# EAGLE design RDN_3103 (EAGLE 9.6.2)

## Sheet 1 of 3
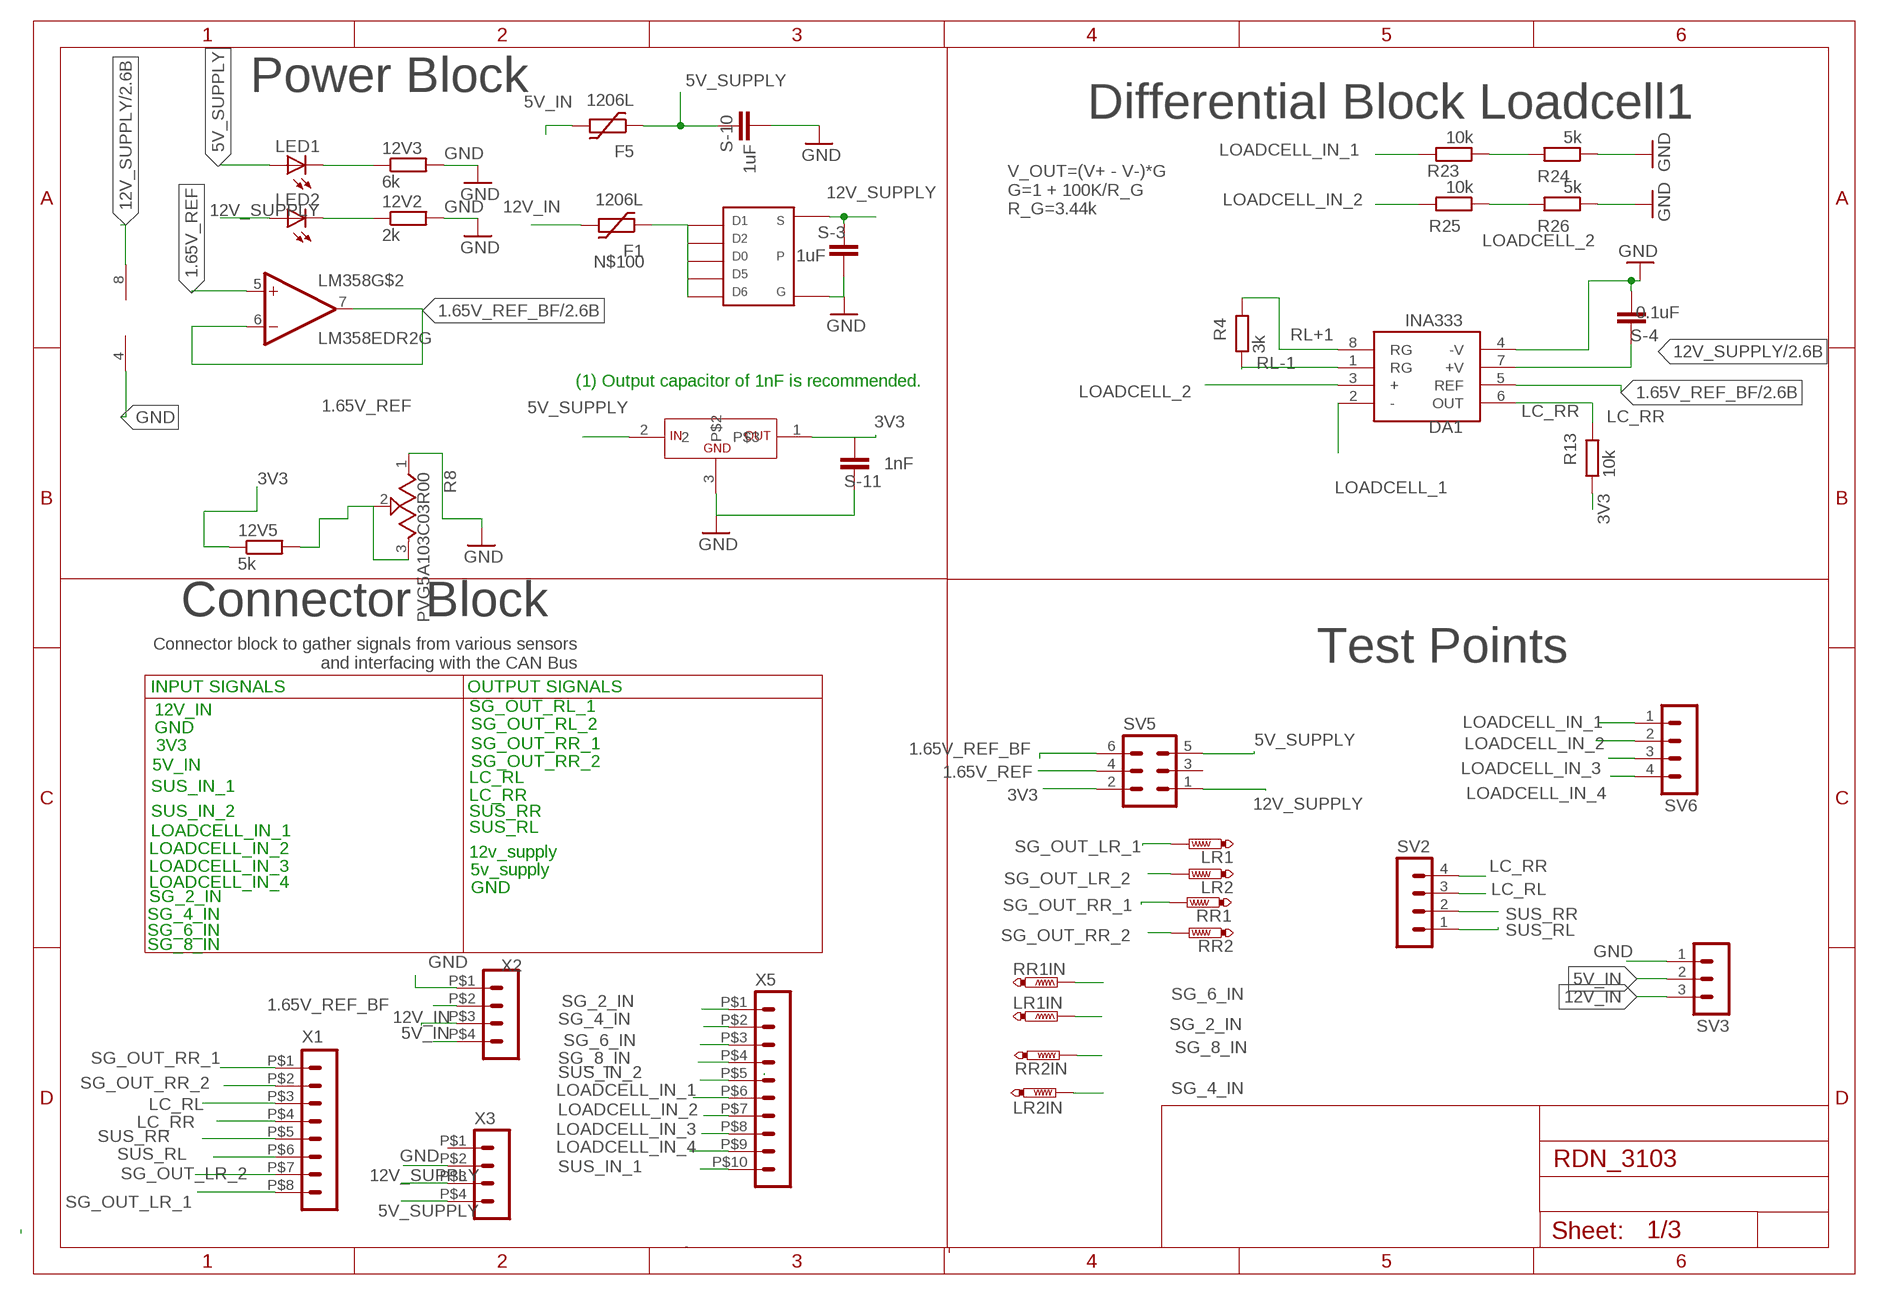
[diagram p0: schematic, sheet 1]

### Parts
12V2  2k  R-EU_R0805  [R0805]
12V3  6k  R-EU_R0805  [R0805]
12V5  5k  R-EU_R0805  [R0805]
DA1  INA333  [MSOP8]
F1  1206L  [1206L]
F5  1206L  [1206L]
LED1  LEDCHIPLED_1206  [CHIPLED_1206]
LED2  LEDCHIPLED_1206  [CHIPLED_1206]
LM358  LM358EDR2G  [SOIC-8]
LR1  PTR1PAD1-13  [P1-13]
LR1IN  PTR1PAD1-13  [P1-13]
LR2  PTR1PAD1-13  [P1-13]
LR2IN  PTR1PAD1-13  [P1-13]
R4  3k  R-EU_R0805  [R0805]
R8  PVG5A103C03R00  [TRIM_PVG5A103C03R00]
R13  10k  R-EU_R0805  [R0805]
R23  10k  R-EU_R0805  [R0805]
R24  5k  R-EU_R0805  [R0805]
R25  10k  R-EU_R0805  [R0805]
R26  5k  R-EU_R0805  [R0805]
RR1  PTR1PAD1-13  [P1-13]
RR1IN  PTR1PAD1-13  [P1-13]
RR2  PTR1PAD1-13  [P1-13]
RR2IN  PTR1PAD1-13  [P1-13]
S-3  1uF  C-EUC0805  [C0805]
S-4  0.1uF  C-EUC0805  [C0805]
S-10  1uF  C-EUC0805  [C0805]
S-11  1nF  C-EUC0805  [C0805]
SV2  MA04-1  [MA04-1]
SV3  MA03-1  [MA03-1]
SV5  MA03-2  [MA03-2]
SV6  MA04-1  [MA04-1]
U$1  TSOP-6_PMOS  [TSOP-6_PMOS]
U$3  3V3_REGULATOR  [SOT-23]
X1  HEADER_POS8_43045-0800  [43045-0800]
X2  HEADER_POS4_43045-0401  [43045-0400]
X3  HEADER_POS4_43045-0401  [43045-0400]
X5  HEADER_POS10_43045-1000  [43045-1000]

### Nets
1.65V_REF: 12V5.2 LM358.5(+IN) R8.2 R8.3 SV5.4
1.65V_REF_BF: DA1.5(REF) LM358.6(-IN) LM358.7(OUT) SV5.6 X2.P$2 ; also sheet 2,3
3V3: 12V5.1 R13.1 S-11.2 SV5.2 U$3.1 ; also sheet 2,3
5V_IN: F5.P$2 SV3.2 X2.P$4
5V_SUPPLY: F5.P$1 LED1.A S-10.1 SV5.5 U$3.2 X3.P$4 ; also sheet 3
12V_IN: F1.P$2 SV3.3 X2.P$3
12V_SUPPLY: DA1.7(+V) LED2.A LM358.8(V+) S-3.1 S-4.1 SV5.1 U$1.S X3.P$3 ; also sheet 2,3
GND: 12V2.2 12V3.2 DA1.4(-V) LM358.4(V-) R8.1 R24.1 R26.1 S-3.2 S-4.2 S-10.2 S-11.1 SV3.1 U$1.G U$3.3 X2.P$1 X3.P$2 ; also sheet 2,3
LC_RL: SV2.3 X1.P$3 ; also sheet 2
LC_RR: DA1.6(OUT) R13.2 SV2.4 X1.P$4
LOADCELL_1: DA1.2(-) R23.1 R24.2
LOADCELL_2: DA1.3(+) R25.1 R26.2
LOADCELL_IN_1: R23.2 SV6.1 X5.P$6
LOADCELL_IN_2: R25.2 SV6.2 X5.P$7
LOADCELL_IN_3: SV6.3 X5.P$8 ; also sheet 2
LOADCELL_IN_4: SV6.4 X5.P$9 ; also sheet 2
N$5: 12V2.1 LED2.C
N$29: 12V3.1 LED1.C
N$100: F1.P$1 U$1.1 U$1.2 U$1.5 U$1.6 U$1.D(D0)
RL+1: DA1.8(RG) R4.2
RL-1: DA1.1(RG) R4.1
SG_2_IN: LR1IN.TP X5.P$1 ; also sheet 2,3
SG_4_IN: LR2IN.TP X5.P$2 ; also sheet 2,3
SG_6_IN: RR1IN.TP X5.P$3 ; also sheet 2,3
SG_8_IN: RR2IN.TP X5.P$4 ; also sheet 3
SG_OUT_LR_1: LR1.TP X1.P$8 ; also sheet 2
SG_OUT_LR_2: LR2.TP X1.P$7 ; also sheet 2
SG_OUT_RR_1: RR1.TP X1.P$1 ; also sheet 2
SG_OUT_RR_2: RR2.TP X1.P$2 ; also sheet 3
SUS_IN_1: X5.P$10 ; also sheet 3
SUS_IN_2: X5.P$5 ; also sheet 3
SUS_RL: SV2.1 X1.P$6 ; also sheet 3
SUS_RR: SV2.2 X1.P$5 ; also sheet 3
Unconnected: LM358.1(OUT) LM358.2(-IN) LM358.3(+IN) SV5.3 X3.P$1

### Notes on the sheet
- Power Block
- Differential Block Loadcell1
- V_OUT=(V+ - V-)*G
  G=1 + 100K/R_G
  R_G=3.44k
- (1) Output capacitor of 1nF is recommended.
- Connector Block
- Connector block to gather signals from various sensors
   and interfacing with the CAN Bus
- Test Points
- INPUT SIGNALS | OUTPUT SIGNALS
- 12V_IN | SG_OUT_RL_1
- GND | SG_OUT_RL_2
- 3V3 | SG_OUT_RR_1
- 5V_IN | SG_OUT_RR_2
- LC_RL
- SUS_IN_1
- LC_RR
- SUS_IN_2 | SUS_RR
- LOADCELL_IN_1 | SUS_RL
- LOADCELL_IN_2 | 12v_supply
- LOADCELL_IN_3 | 5v_supply
- LOADCELL_IN_4
- GND
- SG_2_IN
- SG_4_IN
- SG_6_IN
- SG_8_IN

## Sheet 2 of 3
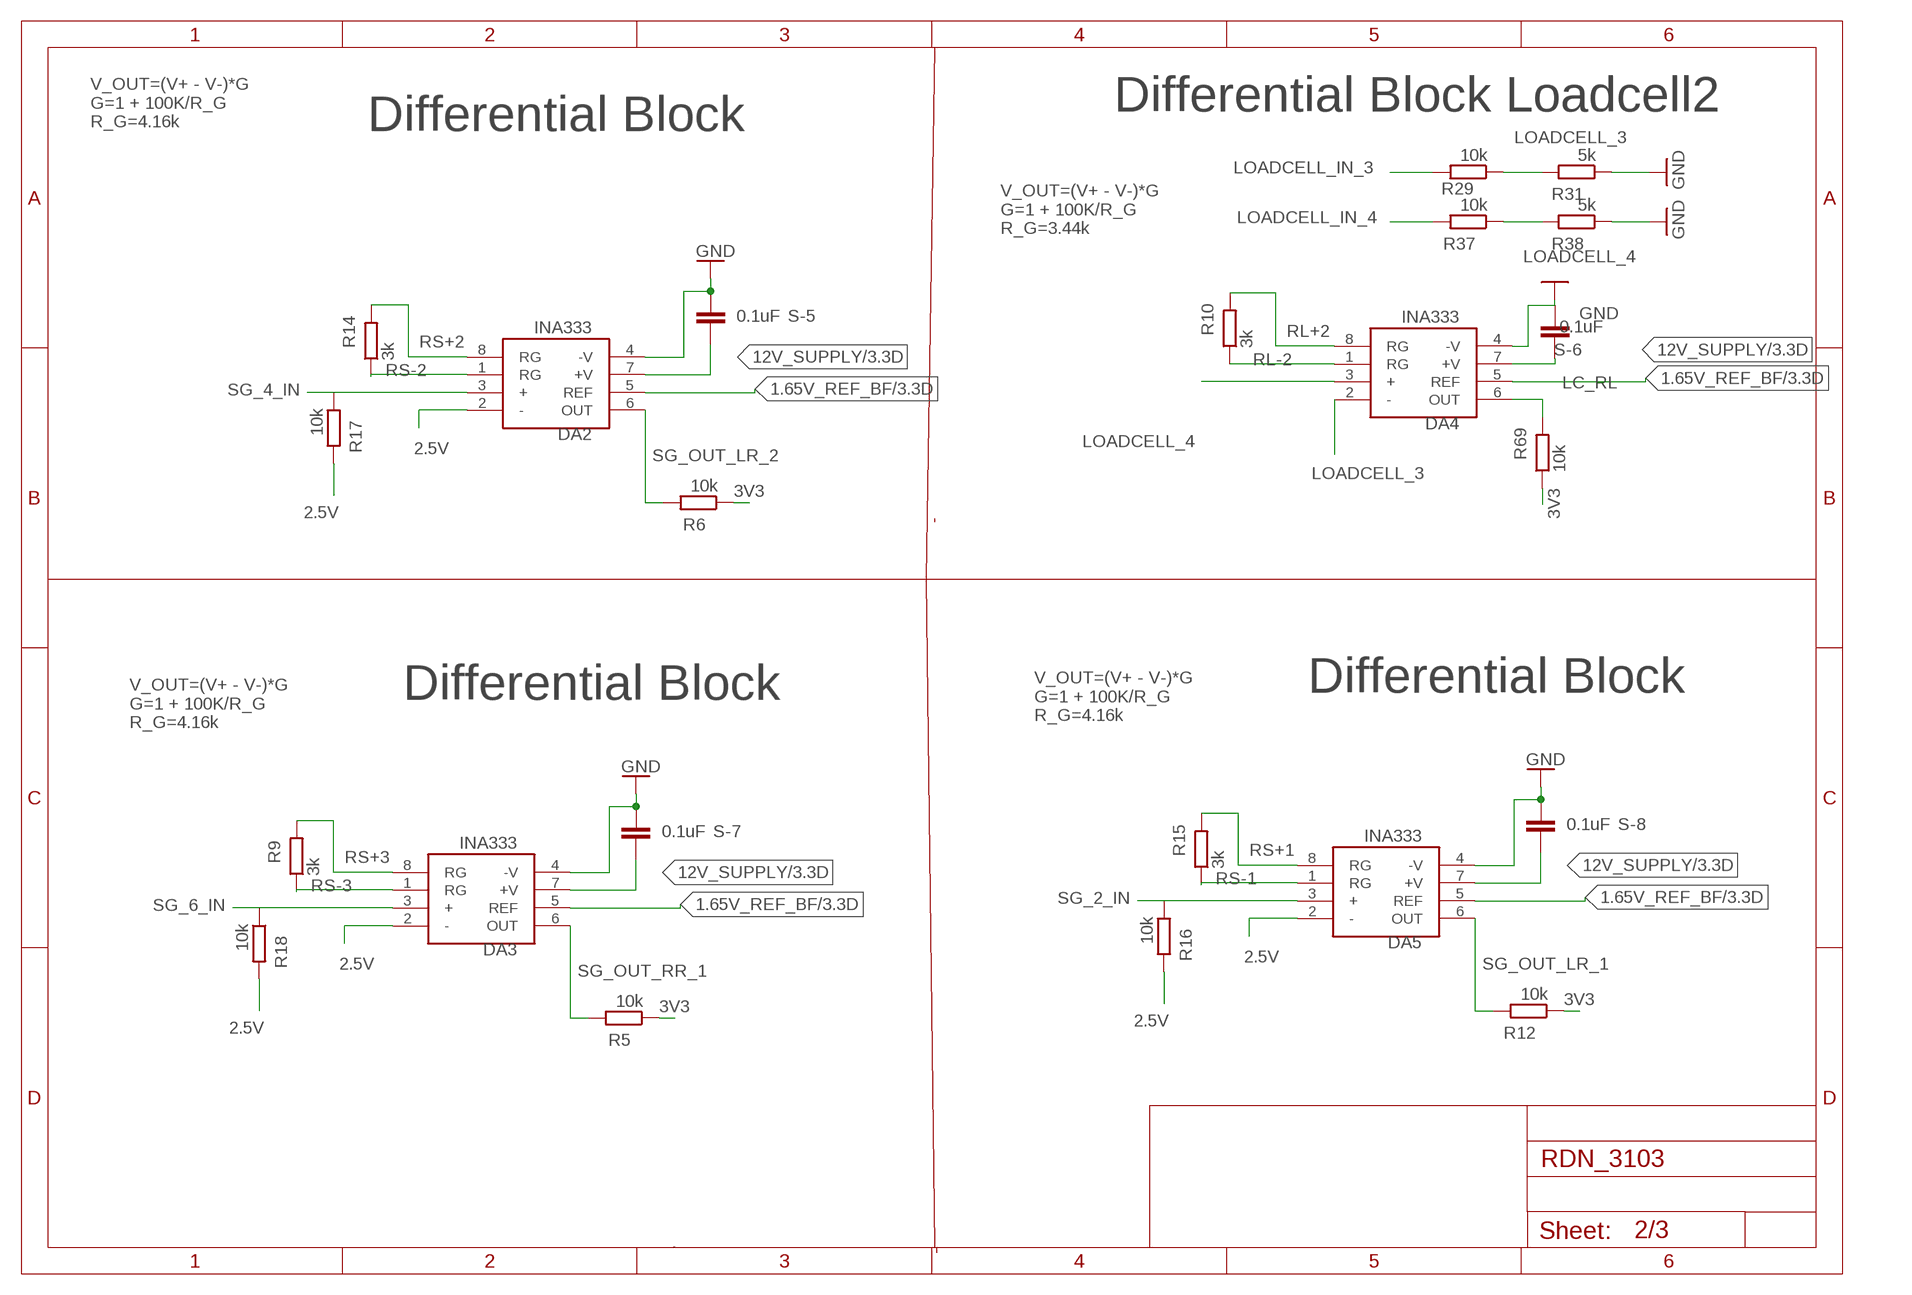
[diagram p1: schematic, sheet 2]

### Parts
DA2  INA333  [MSOP8]
DA3  INA333  [MSOP8]
DA4  INA333  [MSOP8]
DA5  INA333  [MSOP8]
R5  10k  R-EU_R0805  [R0805]
R6  10k  R-EU_R0805  [R0805]
R9  3k  R-EU_R0805  [R0805]
R10  3k  R-EU_R0805  [R0805]
R12  10k  R-EU_R0805  [R0805]
R14  3k  R-EU_R0805  [R0805]
R15  3k  R-EU_R0805  [R0805]
R16  10k  R-EU_R0805  [R0805]
R17  10k  R-EU_R0805  [R0805]
R18  10k  R-EU_R0805  [R0805]
R29  10k  R-EU_R0805  [R0805]
R31  5k  R-EU_R0805  [R0805]
R37  10k  R-EU_R0805  [R0805]
R38  5k  R-EU_R0805  [R0805]
R69  10k  R-EU_R0805  [R0805]
S-5  0.1uF  C-EUC0805  [C0805]
S-6  0.1uF  C-EUC0805  [C0805]
S-7  0.1uF  C-EUC0805  [C0805]
S-8  0.1uF  C-EUC0805  [C0805]

### Nets
1.65V_REF_BF: DA2.5(REF) DA3.5(REF) DA4.5(REF) DA5.5(REF) ; also sheet 1,3
2.5V: DA2.2(-) DA3.2(-) DA5.2(-) R16.2 R17.2 R18.2 ; also sheet 3
3V3: R5.1 R6.1 R12.1 R69.1 ; also sheet 1,3
12V_SUPPLY: DA2.7(+V) DA3.7(+V) DA4.7(+V) DA5.7(+V) S-5.1 S-6.1 S-7.1 S-8.1 ; also sheet 1,3
GND: DA2.4(-V) DA3.4(-V) DA4.4(-V) DA5.4(-V) R31.1 R38.1 S-5.2 S-6.2 S-7.2 S-8.2 ; also sheet 1,3
LC_RL: DA4.6(OUT) R69.2 ; also sheet 1
LOADCELL_3: DA4.2(-) R29.1 R31.2
LOADCELL_4: DA4.3(+) R37.1 R38.2
LOADCELL_IN_3: R29.2 ; also sheet 1
LOADCELL_IN_4: R37.2 ; also sheet 1
RL+2: DA4.8(RG) R10.2
RL-2: DA4.1(RG) R10.1
RS+1: DA5.8(RG) R15.2
RS+2: DA2.8(RG) R14.2
RS+3: DA3.8(RG) R9.2
RS-1: DA5.1(RG) R15.1
RS-2: DA2.1(RG) R14.1
RS-3: DA3.1(RG) R9.1
SG_2_IN: DA5.3(+) R16.1 ; also sheet 1,3
SG_4_IN: DA2.3(+) R17.1 ; also sheet 1,3
SG_6_IN: DA3.3(+) R18.1 ; also sheet 1,3
SG_OUT_LR_1: DA5.6(OUT) R12.2 ; also sheet 1
SG_OUT_LR_2: DA2.6(OUT) R6.2 ; also sheet 1
SG_OUT_RR_1: DA3.6(OUT) R5.2 ; also sheet 1

### Notes on the sheet
- Differential Block Loadcell2
- V_OUT=(V+ - V-)*G
  G=1 + 100K/R_G
  R_G=4.16k
- Differential Block
- V_OUT=(V+ - V-)*G
  G=1 + 100K/R_G
  R_G=3.44k
- Differential Block | Differential Block
- V_OUT=(V+ - V-)*G
  G=1 + 100K/R_G
  R_G=4.16k
- V_OUT=(V+ - V-)*G
  G=1 + 100K/R_G
  R_G=4.16k

## Sheet 3 of 3
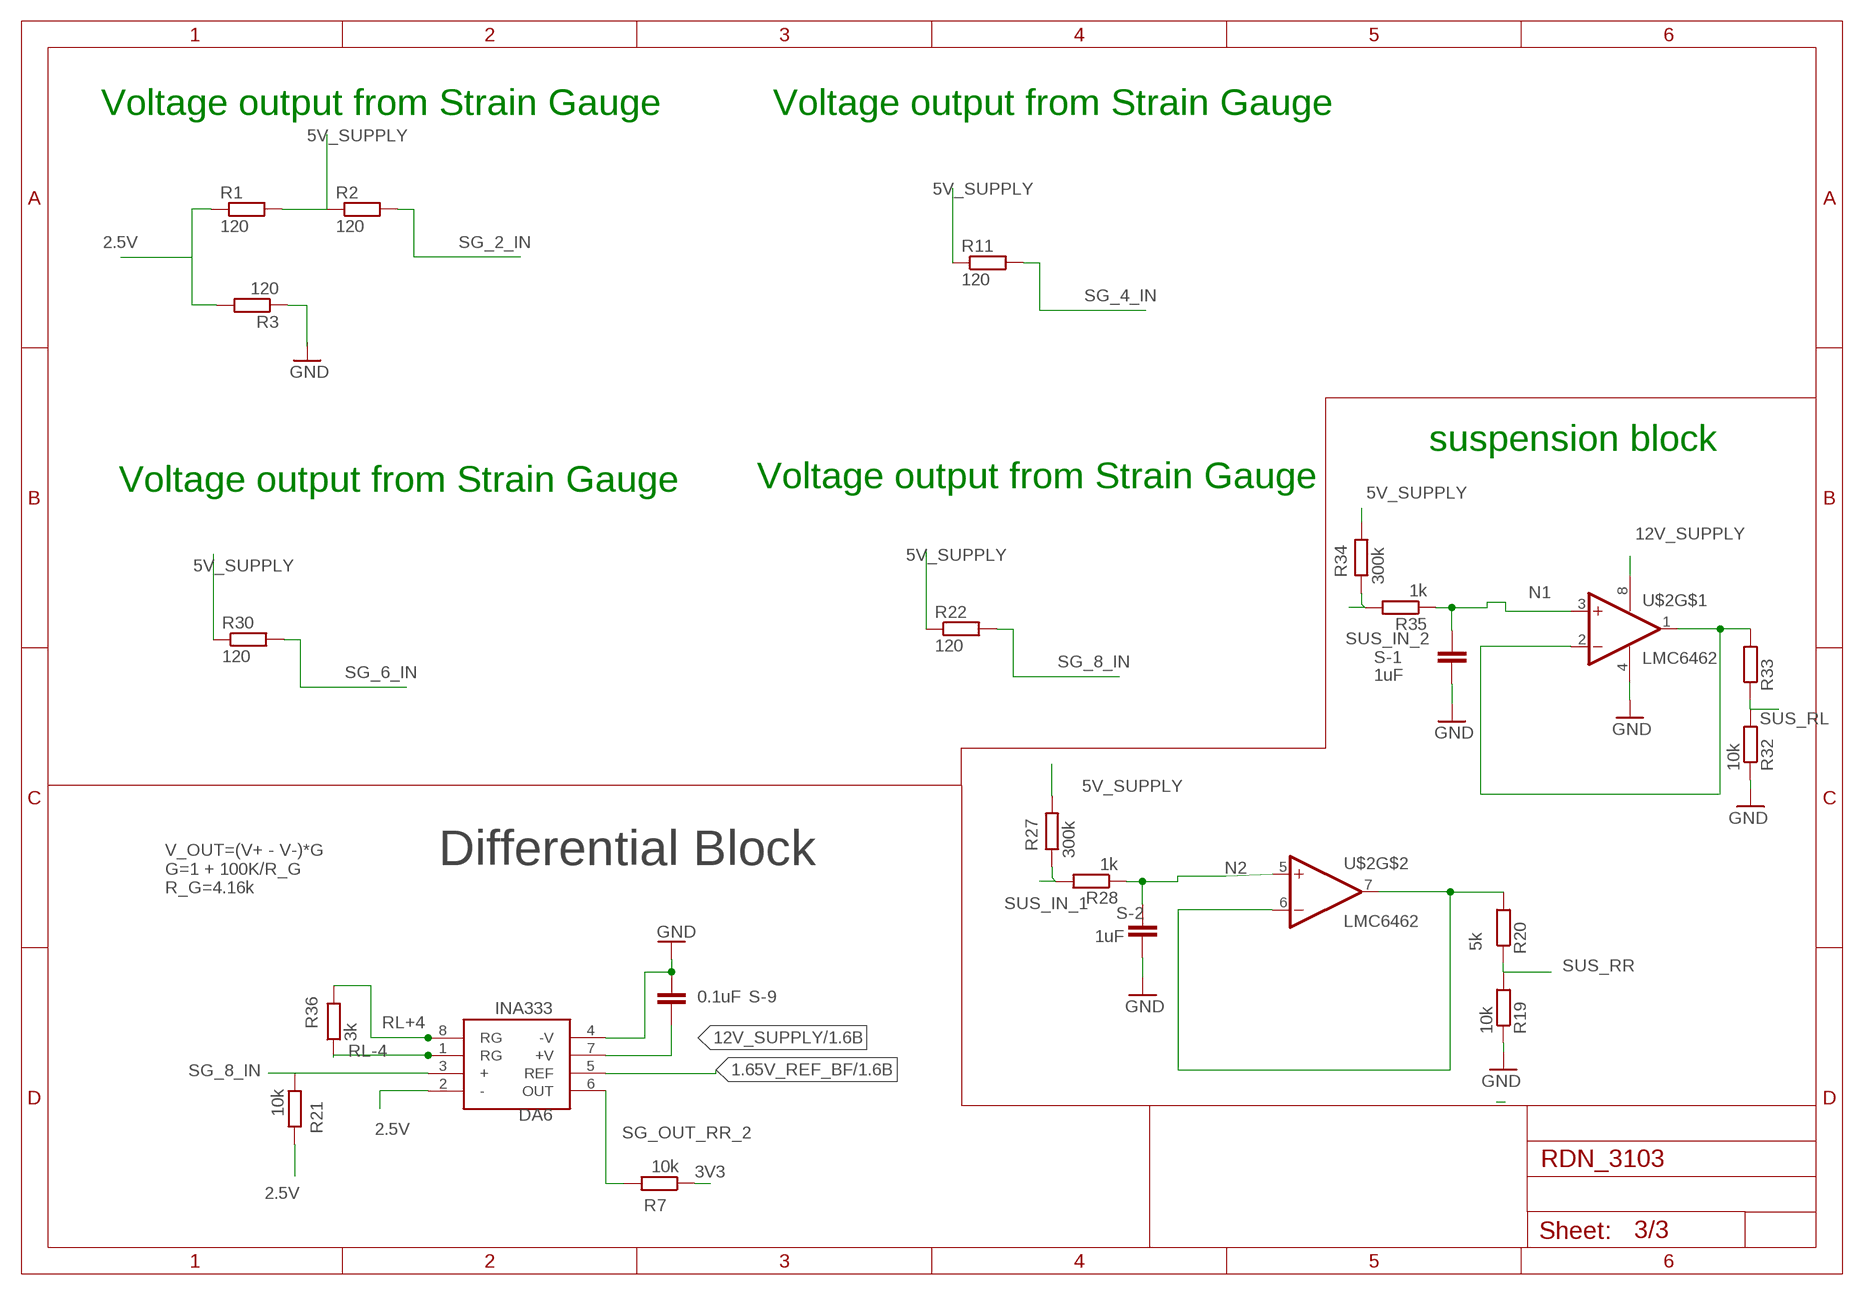
[diagram p2: schematic, sheet 3]

### Parts
DA6  INA333  [MSOP8]
R1  120  R-EU_R0805  [R0805]
R2  120  R-EU_R0805  [R0805]
R3  120  R-EU_R0805  [R0805]
R7  10k  R-EU_R0805  [R0805]
R11  120  R-EU_R0805  [R0805]
R19  10k  R-EU_R0805  [R0805]
R20  5k  R-EU_R0805  [R0805]
R21  10k  R-EU_R0805  [R0805]
R22  120  R-EU_R0805  [R0805]
R27  300k  R-EU_R0805  [R0805]
R28  1k  R-EU_R0805  [R0805]
R30  120  R-EU_R0805  [R0805]
R32  10k  R-EU_R0805  [R0805]
R33  5k  R-EU_R0805  [R0805]
R34  300k  R-EU_R0805  [R0805]
R35  1k  R-EU_R0805  [R0805]
R36  3k  R-EU_R0805  [R0805]
S-1  1uF  C-EUC0805  [C0805]
S-2  1uF  C-EUC0805  [C0805]
S-9  0.1uF  C-EUC0805  [C0805]
U$2  LMC6462  [S08]

### Nets
1.65V_REF_BF: DA6.5(REF) ; also sheet 1,2
2.5V: DA6.2(-) R1.1 R3.2 R21.2 ; also sheet 2
3V3: R7.1 ; also sheet 1,2
5V_SUPPLY: R1.2 R2.1 R11.1 R22.1 R27.2 R30.1 R34.2 ; also sheet 1
12V_SUPPLY: DA6.7(+V) S-9.1 U$2.8(V+) ; also sheet 1,2
GND: DA6.4(-V) R3.1 R19.1 R32.1 S-1.2 S-2.2 S-9.2 U$2.4(V-) ; also sheet 1,2
N1: R35.1 S-1.1 U$2.3(+IN)
N2: R28.1 S-2.1 U$2.5(+IN)
N$15: R20.2 U$2.6(-IN) U$2.7(OUT)
N$20: R33.2 U$2.1(OUT) U$2.2(-IN)
RL+4: DA6.8(RG) R36.2
RL-4: DA6.1(RG) R36.1
SG_2_IN: R2.2 ; also sheet 1,2
SG_4_IN: R11.2 ; also sheet 1,2
SG_6_IN: R30.2 ; also sheet 1,2
SG_8_IN: DA6.3(+) R21.1 R22.2 ; also sheet 1
SG_OUT_RR_2: DA6.6(OUT) R7.2 ; also sheet 1
SUS_IN_1: R27.1 R28.2 ; also sheet 1
SUS_IN_2: R34.1 R35.2 ; also sheet 1
SUS_RL: R32.2 R33.1 ; also sheet 1
SUS_RR: R19.2 R20.1 ; also sheet 1

### Notes on the sheet
- Voltage output from Strain Gauge | Voltage output from Strain Gauge
- suspension block
- Voltage output from Strain Gauge | Voltage output from Strain Gauge
- Differential Block
- V_OUT=(V+ - V-)*G
  G=1 + 100K/R_G
  R_G=4.16k

## Library data of the parts
12V2 12V3 12V5 R1-R3 R11 R22 R30 = rcl:R-EU_: RESISTOR, European symbol; SPICEPREFIX: R
DA1-DA6 = INA333:INA333: Check availability <https://pricing.snapeda.com/parts/INA333/Texas%20Instruments/view-part?ref=eda>; AVAILABILITY: Not in stock; CHECK_PRICES: https://www.snapeda.com/parts/INA333/Texas+Instruments/view-part/?ref=eda; DESCRIPTION: Instrumentation Amplifier 1 Circuit Rail-to-Rail 8-CDIP SB; MF: Texas Instruments; MP: INA333; PACKAGE: None; PRICE: None; SNAPEDA_LINK: https://www.snapeda.com/parts/INA333/Texas+Instruments/view-part/?ref=snap
F1 F5 = IIT_BOMBAY_Racing:1206L
LED1 = led:LED: LED OSRAM: - CHIPLED LG R971, LG N971, LY N971, LG Q971, LY Q971, LO R971, LY R971 LH N974, LH R974 LS Q976, LO Q976, LY Q976 LO Q996 - Hyper CHIPLED LW Q18S LB Q993, LB Q99A, LB R99A - SideLED LS A670, LO A670, LY A670, LG A670, LP A670 LB A673, LV A673, LT A673, LW A673 LH A674 LY A675 LS A676, LA A676, LO A676, LY A676, LW A676 LS A679, LY A679, LG A679 - Hyper Micro SIDELED® LS Y876, LA Y876, LO Y876, LY Y876 LT Y87S - SmartLED LW L88C, LW L88S LB L89C, LB L89S, LG L890 LS L89K, LO L89K, LY L89K LS L896, LA L896, LO L896, LY L896 - TOPLED LS T670, LO T670, LY T670, LG T670, LP T670 LSG T670, LSP T670, LSY T670, LOP T670, LYG T670 LG T671, LOG T671, LSG T671 LB T673, LV T673, LT T673, LW T673 LH T674 LS T676, LA T676, LO T676, LY T676, LB T676, LH T676, LSB T676, LW T676 LB T67C, LV T67C, LT T67C, LS T67K, LO T67K, LY T67K, LW E67C LS E67B, LA E67B, LO E67B, LY E67B, LB E67C, LV E67C, LT E67C LW T67C LS T679, LY T679, LG T679 LS T770, LO T770, LY T770, LG T770, LP T770 LB T773, LV T773, LT T773, LW T773 LH T774 LS E675, LA E675, LY E675, LS T675 LS T776, LA T776, LO T776, LY T776, LB T776 LHGB T686 LT T68C, LB T68C - Hyper Mini TOPLED® LB M676 - Mini TOPLED Santana® LG M470 LS M47K, LO M47K, LY M47K Source: http://www.osram.convergy.de LUXEON: - LUMILED® LXK2-PW12-R00, LXK2-PW12-S00, LXK2-PW14-U00, LXK2-PW14-V00 LXK2-PM12-R00, LXK2-PM12-S00, LXK2-PM14-U00 LXK2-PE12-Q00, LXK2-PE12-R00, LXK2-PE12-S00, LXK2-PE14-T00, LXK2-PE14-U00 LXK2-PB12-K00, LXK2-PB12-L00, LXK2-PB12-M00, LXK2-PB14-N00, LXK2-PB14-P00, LXK2-PB14-Q00 LXK2-PR12-L00, LXK2-PR12-M00, LXK2-PR14-Q00, LXK2-PR14-R00 LXK2-PD12-Q00, LXK2-PD12-R00, LXK2-PD12-S00 LXK2-PH12-R00, LXK2-PH12-S00 LXK2-PL12-P00, LXK2-PL12-Q00, LXK2-PL12-R00 Source: www.luxeon.com KINGBRIGHT: KA-3528ASYC Source: www.kingbright.com
LED2 = led:LED: LED OSRAM: - CHIPLED LG R971, LG N971, LY N971, LG Q971, LY Q971, LO R971, LY R971 LH N974, LH R974 LS Q976, LO Q976, LY Q976 LO Q996 - Hyper CHIPLED LW Q18S LB Q993, LB Q99A, LB R99A - SideLED LS A670, LO A670, LY A670, LG A670, LP A670 LB A673, LV A673, LT A673, LW A673 LH A674 LY A675 LS A676, LA A676, LO A676, LY A676, LW A676 LS A679, LY A679, LG A679 - Hyper Micro SIDELED® LS Y876, LA Y876, LO Y876, LY Y876 LT Y87S - SmartLED LW L88C, LW L88S LB L89C, LB L89S, LG L890 LS L89K, LO L89K, LY L89K LS L896, LA L896, LO L896, LY L896 - TOPLED LS T670, LO T670, LY T670, LG T670, LP T670 LSG T670, LSP T670, LSY T670, LOP T670, LYG T670 LG T671, LOG T671, LSG T671 LB T673, LV T673, LT T673, LW T673 LH T674 LS T676, LA T676, LO T676, LY T676, LB T676, LH T676, LSB T676, LW T676 LB T67C, LV T67C, LT T67C, LS T67K, LO T67K, LY T67K, LW E67C LS E67B, LA E67B, LO E67B, LY E67B, LB E67C, LV E67C, LT E67C LW T67C LS T679, LY T679, LG T679 LS T770, LO T770, LY T770, LG T770, LP T770 LB T773, LV T773, LT T773, LW T773 LH T774 LS E675, LA E675, LY E675, LS T675 LS T776, LA T776, LO T776, LY T776, LB T776 LHGB T686 LT T68C, LB T68C - Hyper Mini TOPLED® LB M676 - Mini TOPLED Santana® LG M470 LS M47K, LO M47K, LY M47K Source: http://www.osram.convergy.de LUXEON: - LUMILED® LXK2-PW12-R00, LXK2-PW12-S00, LXK2-PW14-U00, LXK2-PW14-V00 LXK2-PM12-R00, LXK2-PM12-S00, LXK2-PM14-U00 LXK2-PE12-Q00, LXK2-PE12-R00, LXK2-PE12-S00, LXK2-PE14-T00, LXK2-PE14-U00 LXK2-PB12-K00, LXK2-PB12-L00, LXK2-PB12-M00, LXK2-PB14-N00, LXK2-PB14-P00, LXK2-PB14-Q00 LXK2-PR12-L00, LXK2-PR12-M00, LXK2-PR14-Q00, LXK2-PR14-R00 LXK2-PD12-Q00, LXK2-PD12-R00, LXK2-PD12-S00 LXK2-PH12-R00, LXK2-PH12-S00 LXK2-PL12-P00, LXK2-PL12-Q00, LXK2-PL12-R00 Source: www.luxeon.com KINGBRIGHT: KA-3528ASYC Source: www.kingbright.com; SPICEPREFIX: L
LM358 = IIT_BOMBAY_Racing2:LM358EDR2G
LR1 LR1IN LR2 LR2IN RR1 RR1IN RR2 RR2IN = testpad:PTR1: TEST PIN
R4-R7 R9 R10 R12-R18 R21 R23-R26 R29 R31 R36-R38 R69 = IIT_BOMBAY_Racing:R-EU_: RESISTOR, European symbol
R8 = PVG5A103C03R00:PVG5A103C03R00: 1 kOhms 0.25W, 1/4W J Lead Surface Mount Trimmer Potentiometer Cermet 11 Turn Top Adjustment Check availability <https://pricing.snapeda.com/parts/PVG5A103C03R00/Bourns/view-part?ref=eda>; AVAILABILITY: In Stock; CHECK_PRICES: https://www.snapeda.com/parts/PVG5A103C03R00/Bourns/view-part/?ref=eda; DESCRIPTION: 10 kOhms 0.25W, 1/4W J Lead Surface Mount Trimmer Potentiometer Cermet 11.0 Turn Top Adjustment; MF: Bourns; MP: PVG5A103C03R00; PACKAGE: SMD-3 Bourns; PRICE: None; SNAPEDA_LINK: https://www.snapeda.com/parts/PVG5A103C03R00/Bourns/view-part/?ref=snap
R19 R20 R27 R28 R32-R35 = IIT_BOMBAY_Racing2:R-EU_: RESISTOR, European symbol
S-1-S-11 = IIT_BOMBAY_Racing:C-EU: CAPACITOR, European symbol
SV2 SV6 = con-lstb:MA04-1: PIN HEADER; OC_FARNELL: unknown; OC_NEWARK: unknown
SV3 = con-lstb:MA03-1: PIN HEADER; OC_FARNELL: unknown; OC_NEWARK: unknown
SV5 = con-lstb:MA03-2: PIN HEADER; OC_FARNELL: unknown; OC_NEWARK: unknown
U$1 = TSOP-6_MOS:TSOP-6_PMOS
U$2 = IIT_BOMBAY_Racing (1):LMC6462
U$3 = 3V3_REG:3V3_REGULATOR
X1 = IIT_BOMBAY_Racing (1):HEADER_POS8_?: Molex - Micro-Fit 3.0 Series connector, 3.00mm (0.118") pitch header, 8 positions.
X2 X3 = IIT_BOMBAY_Racing (1):HEADER_POS4_?: Molex - Micro-Fit 3.0 Series connector, 3.00mm (0.118") pitch header, 4 positions.
X5 = IIT_BOMBAY_Racing (1):HEADER_POS10_?: Molex - Micro-Fit 3.0 Series connector, 3.00mm (0.118") pitch header, 10 positions.

## Board
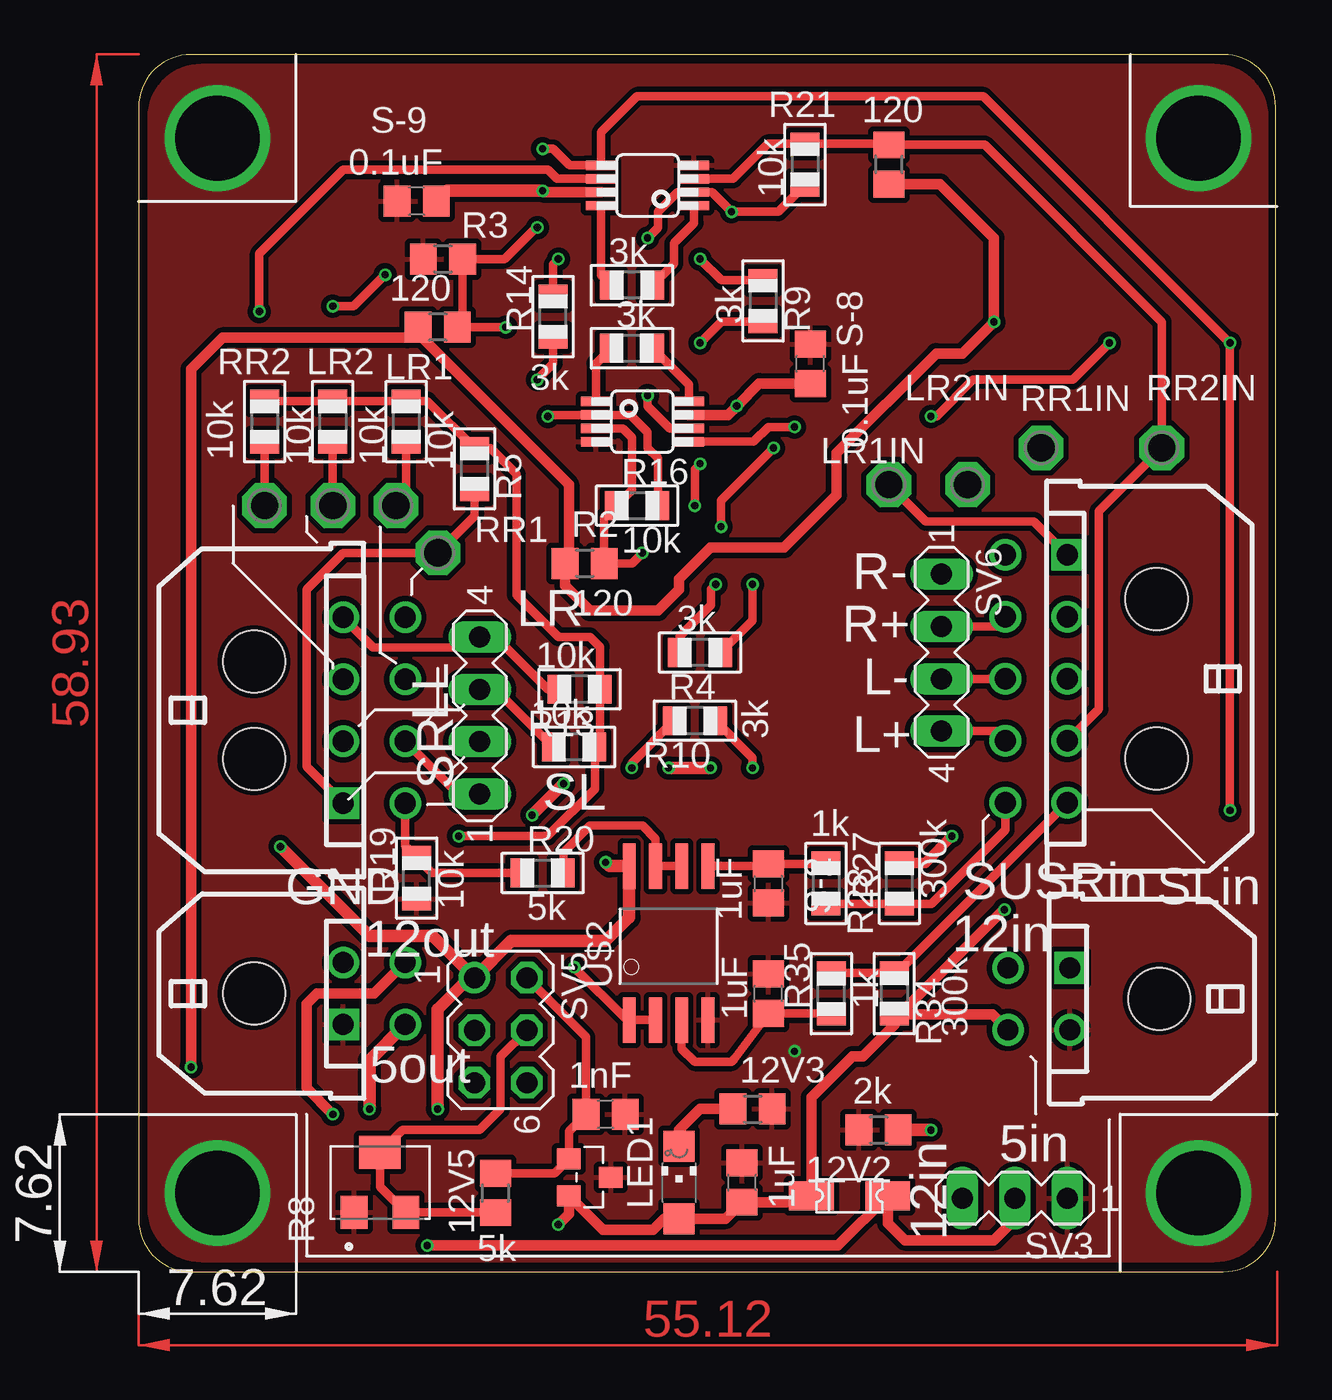
[diagram p3: board, top side]
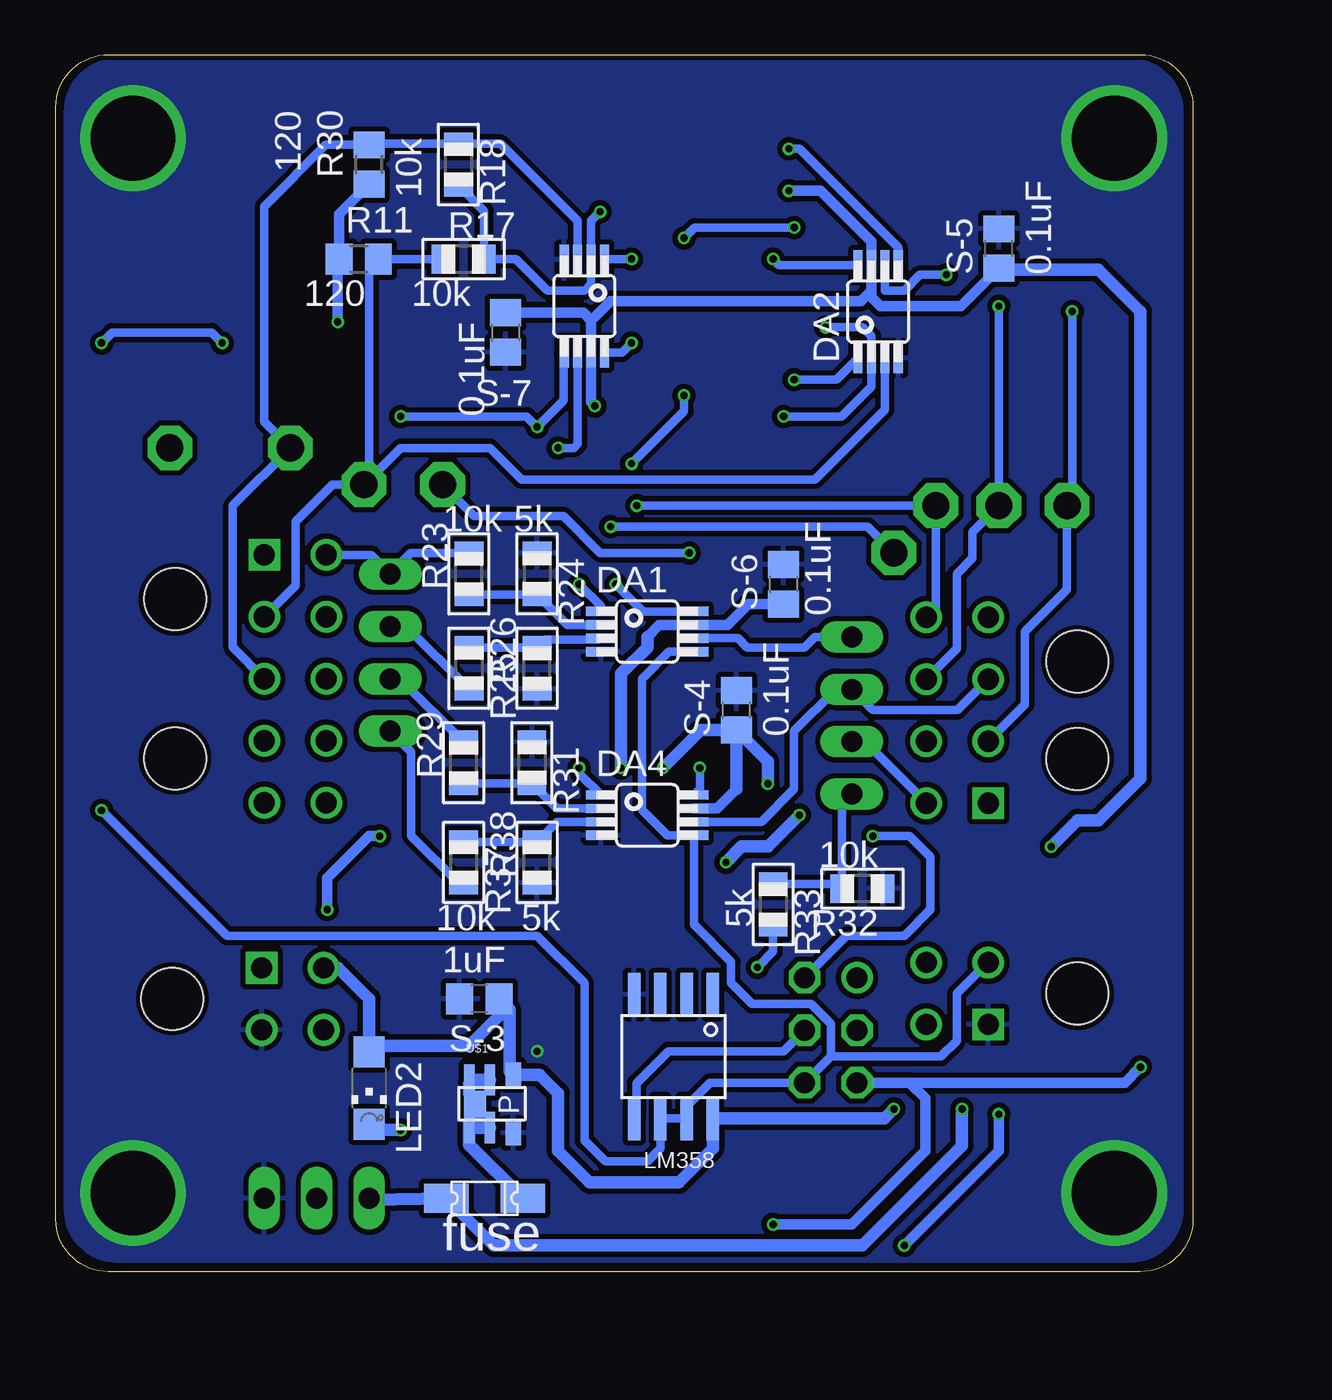
[diagram p4: board, bottom side, seen from below]

Size 55.04 x 58.92 mm. Coordinates in mm from the lower left corner, seen from the top.
Outline: 0,56.38 0,2.54 arc90 2.54,0 52.5,0 arc90 55.04,2.54 55.04,56.38 arc90 52.5,58.92 2.54,58.92 arc90 0,56.38
Copper layers (1*16): Top 0.035mm / dielectric 1.5mm / Bottom 0.035mm
Design rules "PCB_Power": minimum track width 5mil, minimum drill 10mil, track to track 5mil, track to pad 5mil, pad to pad 5mil, via to via 5mil, smd to smd 5mil, copper to edge 10mil, drill to drill 6mil, minimum pad ring 5mil, minimum via ring 5mil, stop-mask expansion 3mil, vias tented up to drill 0mil, thermal gap 10mil

### Footprints (pad centres in the part's own frame; a part is rotated, then mirrored left to right if it is on the bottom)
R0805 = smd 1.3 x 1.5: 1 -0.95,0; 2 0.95,0
MSOP8 = smd 0.45 x 1.45: 1 -0.975,-2.25; 2 -0.325,-2.25; 3 0.325,-2.25; 4 0.975,-2.25; 5 0.975,2.25; 6 0.325,2.25; 7 -0.325,2.25; 8 -0.975,2.25
1206L = smd 2.16 x 1.4: P$1 -1.85,0; P$2 1.85,0
CHIPLED_1206 = smd 1.5 x 1.5: A 0,-1.75; C 0,1.75
SOIC-8 = smd 0.6 x 2.1: 1 -1.905,-3; 2 -0.635,-3; 3 0.635,-3; 4 1.905,-3; 5 1.905,3; 6 0.635,3; 7 -0.635,3; 8 -1.905,3
P1-13 = drill 1.321 pad 2.159 octagon: TP 0,0
R0805' = smd 1.1 x 1.4: 1 -1,0; 2 1,0
TRIM_PVG5A103C03R00 = smd 1.6 x 1.3: 1 -1.45,1.25; 3 -1.45,-1.25 | smd 1.6 x 2: 2 1.45,0
C0805 = smd 1.3 x 1.5: 1 -0.95,0; 2 0.95,0
MA04-1 = drill 1.016 long: 1 -3.81,0; 2 -1.27,0; 3 1.27,0; 4 3.81,0
MA03-1 = drill 1.016 long: 1 -2.54,0; 2 0,0; 3 2.54,0
MA03-2 = drill 1.016: 1 -2.54,-1.27 | drill 1.016 octagon: 2 -2.54,1.27; 3 0,-1.27; 4 0,1.27; 5 2.54,-1.27; 6 2.54,1.27
TSOP-6_PMOS = smd 0.5 x 1.92: 1 -1,-0.96; 6 -1,0.96 | smd 0.5 x 1.52: 2 0,-1.16; 5 0,1.16 | smd 0.635 x 1.27: D -0.5,0 | smd 0.75 x 1.2: G 1.13,-1.4; S 1.13,1.4
S08 = smd 0.61 x 2.21: 1 -1.905,-3.569; 2 -0.635,-3.569; 3 0.635,-3.569; 4 1.905,-3.569; 5 1.905,3.886; 6 0.635,3.886; 7 -0.635,3.886; 8 -1.905,3.886
SOT-23 = smd 1.016 x 1.143: 1 -0.889,-1.016; 2 0.889,-1.016; 3 0,1.016
43045-0800 = drill 1.02 square: P$1 4.5,4.32 | drill 1.02: P$2 1.5,4.32; P$3 -1.5,4.32; P$4 -4.5,4.32; P$5 4.5,7.32; P$6 1.5,7.32; P$7 -1.5,7.32; P$8 -4.5,7.32 | hole 3: 2.35,0; -2.35,0
43045-0400 = drill 1.02 square: P$1 1.5,4.32 | drill 1.02: P$2 -1.5,4.32; P$3 1.5,7.32; P$4 -1.5,7.32 | hole 3: 0,0
43045-1000 = drill 1.02 square: P$1 6,4.32 | drill 1.02: P$2 3,4.32; P$3 0,4.32; P$4 -3,4.32; P$5 -6,4.32; P$6 6,7.32; P$7 3,7.32; P$8 0,7.32; P$9 -3,7.32; P$10 -6,7.32 | hole 3: 3.85,0; -3.85,0

### Placement (x,y rotation side)
12V2  35.81,6.86 180 top
12V3  29.72,7.87 0 top
12V5  17.27,3.81 270 top
DA1  26.42,30.99 270 bottom
DA2  15.24,46.48 0 bottom
DA3  29.46,46.74 180 bottom
DA4  26.42,22.1 270 bottom
DA5  24.38,41.15 270 top
DA6  24.64,52.58 90 top
F1  34.29,3.56 180 bottom
F5  34.42,3.68 0 top
LED1  26.16,4.32 0 top
LED2  39.88,8.89 180 bottom
LM358  25.15,10.41 180 bottom
LR1  12.45,37.08 0 top
LR1IN  36.32,38.1 0 top
LR2  9.4,37.08 0 top
LR2IN  40.13,38.1 0 top
R1  14.48,45.72 180 top
R2  21.59,34.29 0 top
R3  14.73,49.02 0 top
R4  3k  [R0805']  27.18,29.97 180 top
R5  10k  [R0805']  16.26,38.86 270 top
R6  10k  [R0805']  9.4,41.15 270 top
R7  10k  [R0805']  6.1,41.15 270 top
R8  11.68,4.32 90 top
R9  3k  [R0805']  30.23,46.99 270 top
R10  3k  [R0805']  26.92,26.67 180 top
R11  40.39,49.02 0 bottom
R12  10k  [R0805']  12.95,41.15 270 top
R13  10k  [R0805']  21.34,28.19 180 top
R14  3k  [R0805']  20.07,46.23 90 top
R15  3k  [R0805']  23.88,44.7 0 top
R16  10k  [R0805']  24.13,37.08 0 top
R17  10k  [R0805']  35.31,49.02 0 bottom
R18  10k  [R0805']  35.56,53.59 270 bottom
R19  10k  [R0805']  13.46,19.05 90 top
R20  5k  [R0805']  19.56,19.3 0 top
R21  10k  [R0805']  32.26,53.59 270 top
R22  36.32,53.59 90 top
R23  10k  [R0805']  35.05,33.78 90 bottom
R24  5k  [R0805']  31.75,33.78 270 bottom
R25  10k  [R0805']  35.05,29.21 270 bottom
R26  5k  [R0805']  31.75,29.21 90 bottom
R27  300k  [R0805']  36.83,18.8 90 top
R28  1k  [R0805']  33.27,18.8 270 top
R29  10k  [R0805']  35.31,24.64 90 bottom
R30  39.88,53.59 90 bottom
R31  5k  [R0805']  32,24.64 270 bottom
R32  10k  [R0805']  16,18.54 180 bottom
R33  5k  [R0805']  20.32,17.78 270 bottom
R34  300k  [R0805']  36.58,13.46 270 top
R35  1k  [R0805']  33.53,13.46 90 top
R36  3k  [R0805']  23.88,47.75 180 top
R37  10k  [R0805']  35.31,19.81 270 bottom
R38  5k  [R0805']  31.75,19.81 90 bottom
R69  10k  [R0805']  21.08,25.4 180 top
RR1  14.48,34.8 0 top
RR1IN  43.69,39.88 0 top
RR2  6.1,37.08 0 top
RR2IN  49.53,39.88 0 top
S-1  30.48,13.46 90 top
S-2  30.48,18.8 270 top
S-3  34.54,13.21 180 bottom
S-4  22.1,27.18 90 bottom
S-5  9.4,49.53 90 bottom
S-6  19.81,33.27 90 bottom
S-7  33.27,45.47 270 bottom
S-8  32.51,43.94 90 top
S-9  13.46,51.82 180 top
S-10  29.21,4.32 90 top
S-11  22.61,7.62 180 top
SV2  16.51,26.92 90 top
SV3  42.42,3.56 180 top
SV5  17.53,11.68 270 top
SV6  38.86,29.97 270 top
U$1  34.04,8.13 0 bottom
U$2  25.65,15.75 0 top
U$3  21.84,4.57 270 top
X1  5.59,27.18 270 top
X2  5.59,13.46 270 top
X3  49.4,13.21 90 top
X5  49.28,28.7 90 top

### Tracks (layer width: path | path; a pad name or v marks a point on that pad's centre or on a via)
1.65V_REF
  Top 0.406: 12V5.2 R8.3 11.68,4.12 R8.2 12.77,6.86 16.51,6.86 17.53,7.87 17.53,10.41 SV5.4
  Bottom 0.406: SV5.4 19.81,10.67 25.4,10.67 26.95,9.12 26.95,7.52 LM358.5
1.65V_REF_BF  (via drill 0.35)
  Top 0.406: v19.56,54.36 20.07,54.36 20.87,53.55 DA6.5 22.39,55.15 24.13,56.9 40.89,56.9 v52.83,44.96 v52.83,22.33 | DA5.5 29.76,40.17 30.48,40.89 v31.75,40.89 | v46.99,44.96 45.21,43.18 40.39,43.18 38.61,41.4 v38.35,41.4
  Bottom 0.406: DA1.5 25.36,30.01 26.67,28.7 26.67,22.35 25.44,21.12 DA4.5 24.17,16.8 22.35,14.99 22.35,13.97 21.34,12.95 18.48,12.95 17.53,11.99 17.53,10.41 | DA2.5 14.27,49.57 19.05,54.36 v19.56,54.36 | DA3.5 30.48,44.45 30.48,42.16 v31.75,40.89 32.26,41.4 v38.35,41.4 | v52.83,44.96 52.32,45.47 47.5,45.47 v46.99,44.96 | v52.83,22.33 46.76,16.26 31.75,16.26 29.46,13.97 29.46,6.35 28.45,5.33 26.42,5.33 25.78,5.97 LM358.6 LM358.7 24.51,8 23.37,9.14 SV5.6 17.53,10.41 | X2.P$2 9.93,14.96 11.43,13.46 11.43,11.18 12.19,10.41 17.53,10.41
2.5V  (via drill 0.35)
  Top 0.406: v19.81,41.4 19.88,41.47 DA5.2 23.8,41.47 24.64,40.64 24.64,39.88 25.13,39.39 R16.2 | v17.78,45.72 R1.1 15.68,45.97 R3.2 17.71,49.02 19.24,50.55 v19.3,50.55 | v24.64,50.04 25.15,50.55 25.15,51.31 26.09,52.25 DA6.2 27.76,52.25 v28.7,51.31 30.97,51.31 R21.2
  Bottom 0.406: v19.81,41.4 17.02,41.4 15.56,42.85 DA2.2 15.56,45.28 16,45.72 v17.78,45.72 | v28.7,51.31 29.14,50.87 DA3.2 29.14,47.82 29.46,47.5 31.24,47.5 32.77,49.02 R17.2 34.31,51.34 R18.2 | v19.3,50.55 24.13,50.55 v24.64,50.04
3V3  (via drill 0.35)
  Top 0.406: 12V5.1 20.13,4.76 U$3.1 20.83,6.79 S-11.2 21.66,11.36 SV5.2 | v15.49,21.08 19.8,21.08 22.08,23.37 R69.1 22.34,25.65 R13.1 22.34,30.24 21.84,30.73 20.32,30.73 18.29,32.77 18.29,38.61 17.03,39.86 R5.1 13.97,42.15 R12.1 R6.1 R7.1
  Bottom 0.406: SV5.2 16.76,16.26 13.97,16.26 12.7,17.53 12.7,20.07 13.72,21.08 v15.49,21.08
5V_IN  (via drill 0.35)
  Top 0.508: SV3.2 42.42,2.54 41.4,1.52 37.08,1.52 36.27,2.34 F5.P$2 33.85,1.27 v13.97,1.27 | v9.4,7.62 8.13,8.89 8.13,12.95 8.64,13.46 11.41,13.46 X2.P$4
  Bottom 0.508: v13.97,1.27 9.4,5.84 v9.4,7.62
5V_SUPPLY  (via drill 0.35)
  Top 0.508: R34.2 36.58,11.94 35.05,10.41 34.54,10.41 32.57,8.44 F5.P$1 32.25,3.37 S-10.1 28.41,2.57 LED1.A 25.43,2.57 24.89,2.03 22.48,2.03 U$3.2 20.83,2.79 v20.32,2.29 | v41.91,17.53 41.89,17.53 36.83,12.46 R34.2 | v39.37,21.08 38.08,19.8 R27.2 | R22.1 38.8,52.64 41.4,50.04 v41.4,45.97 39.88,44.45 38.61,44.45 33.78,39.62 33.78,37.59 31.24,35.05 27.69,35.05 26.16,33.53 26.16,33.02 25.15,32 21.84,32 20.64,33.21 R2.1 20.83,34.48 20.83,38.1 13.72,45.21 13.72,45.53 R1.2 13.02,45.21 4.06,45.21 2.54,43.69 v2.54,9.91 | X3.P$4 41.33,12.46 R34.2
  Bottom 0.508: v41.91,17.53 41.91,19.05 39.88,21.08 v39.37,21.08 | v20.32,2.29 16.51,2.29 12.95,5.84 12.95,8.38 13.72,9.14 SV5.5 3.3,9.14 v2.54,9.91 | v41.4,45.97 41.4,48.96 R11.1 41.34,51.19 R30.1
12V_IN  (via drill 0.35)
  Top 0.61: v11.18,7.87 11.18,10.23 X2.P$3
  Bottom 0.61: SV3.3 39.8,3.47 F1.P$2 33.85,1.27 16,1.27 11.18,6.1 v11.18,7.87
12V_SUPPLY  (via drill 0.35)
  Top 0.508: DA6.7 19.63,52.25 v19.56,52.32 | DA5.7 28.52,41.47 v28.96,41.91 30.04,42.99 S-8.1
  Top 0.61: SV5.1 18.03,16 22.61,16 23.75,17.14 U$2.8 22.78,19.63 v22.61,19.81 | v19.56,52.32 14.92,52.32 S-9.1 | v19.05,22.1 v20.57,23.62 | v25.65,24.38 v27.69,24.38 | v14.48,7.87 14.48,12.7 16,14.22 SV5.1 | SV5.1 14.22,16.26 11.18,16.26 v6.86,20.57
  Bottom 0.508: S-6.1 21.52,32.32 22.54,31.31 DA1.7 25.84,31.31 26.42,30.73 | DA4.7 23.04,22.42 22.1,23.37 | v19.56,52.32 18.03,52.32 15.56,49.85 DA2.7 15.56,47.5 | v28.96,41.91 29.14,42.09 DA3.7 29.14,46.05 | 29.14,46.05 28.19,46.99 16.07,46.99 15.56,47.5 | 29.14,46.05 29.51,46.42 S-7.1 | S-5.1 11.24,46.74 15.13,46.74 15.56,47.17 15.56,47.5
  Bottom 0.61: S-5.1 9.33,48.51 4.57,48.51 2.54,46.48 2.54,23.89 4.58,21.84 5.59,21.84 v6.86,20.57 | 22.1,23.37 S-4.1 | v22.61,19.81 21.84,20.57 20.57,20.57 v19.05,22.1 | v20.57,23.62 20.57,24.7 S-4.1 | S-4.1 23.81,26.23 v25.65,24.38 | 26.42,30.73 26.42,30.23 27.69,28.96 v27.69,24.38 | v14.48,7.87 14.94,7.41 LM358.8 23.24,5.97 24.89,4.32 29.21,4.32 30.73,5.84 30.73,8.64 31.63,9.53 U$1.S 33.09,9.71 33.09,12.7 S-3.1 33.59,12.38 35.05,10.92 39.6,10.92 LED2.A 39.88,13.21 41.38,14.71 X3.P$3
GND  (via drill 0.35, 4.1)
  other vias: 3.81,3.81 51.31,3.81 51.31,54.86 3.81,54.86 31.75,10.67
  pour Top (isolate 0.254): 54.61,55.88 54.61,3.05 arc-90 52.07,0.51 3.05,0.51 arc-90 0.51,3.05 0.51,55.88 arc-90 3.05,58.42 52.07,58.42 arc-90
  pour Bottom (isolate 0.254): 54.61,56.13 54.61,3.05 arc-90 52.07,0.51 3.05,0.51 arc-90 0.51,3.05 0.51,56.13 arc-90 3.05,58.67 52.07,58.67 arc-90
LC_RL
  Top 0.406: R69.2 20.07,25.4 17.27,28.19 SV2.3
  Bottom 0.406: DA4.6 20.9,21.77 19.3,23.37 19.3,26.16 17.27,28.19 SV2.3 15.49,27.18 11.41,27.18 X1.P$3
LC_RR
  Top 0.406: R13.2 19.81,28.19 17.27,30.73 SV2.4 16,30.23 11.36,30.23 X1.P$4
  Bottom 0.406: SV2.4 18.29,30.73 18.8,30.23 21.59,30.23 22.03,30.66 DA1.6
LOADCELL_1
  Bottom 0.406: R23.1 R24.2 30.28,31.31 DA1.2
LOADCELL_2
  Bottom 0.406: DA1.3 28.73,30.59 31.37,30.59 R26.2 R25.1
LOADCELL_3
  Bottom 0.406: DA4.2 30.79,22.42 R31.2 R29.1
LOADCELL_4
  Bottom 0.406: DA4.3 30.79,21.77 R38.2 R37.1
LOADCELL_IN_1
  Bottom 0.406: R23.2 37.86,34.78 SV6.1 39.78,34.7 X5.P$6
LOADCELL_IN_2
  Top 0.406: SV6.2 41.5,31.24 X5.P$7
  Bottom 0.406: R25.2 38.08,31.24 SV6.2
LOADCELL_IN_3
  Top 0.406: SV6.3 X5.P$8
  Bottom 0.406: R29.2 38.37,28.7 SV6.3
LOADCELL_IN_4
  Top 0.406: SV6.4 41.5,26.16 X5.P$9
  Bottom 0.406: R37.2 35.56,18.81 37.85,21.1 37.85,25.15 SV6.4
N1
  Top 0.406: U$2.3 26.29,10.79 26.92,10.16 28.7,10.16 28.84,10.3 S-1.1 33.48,12.51 R35.1
N2
  Top 0.406: U$2.5 30.37,19.63 S-2.1 33.22,19.75 R28.1
N$5  (via drill 0.35)
  Top 0.61: 12V2.1 v38.35,6.86
  Bottom 0.61: v38.35,6.86 39.6,6.86 LED2.C
N$15
  Top 0.406: U$2.6 U$2.7 25.02,20.95 24.38,21.59 21.84,21.59 20.56,20.3 R20.2
N$20  (via drill 0.35)
  Top 0.406: U$2.2 U$2.1 23.64,12.18 v21.08,14.73
  Bottom 0.406: R33.2 20.32,15.49 v21.08,14.73
N$29
  Top 0.508: LED1.C 26.16,6.86 27.18,7.87 12V3.1
N$100
  Bottom 0.61: F1.P$1 35.04,6.15 U$1.1 | U$1.1 34.84,6.97 U$1.2 | U$1.5 34.84,9.29 U$1.6 35.04,8.63 U$1.D 34.54,7.67 U$1.1
RL+1  (via drill 0.35)
  Top 0.406: v27.94,33.27 27.71,33.04 27.71,32.28 26.18,30.75 R4.2
  Bottom 0.406: v27.94,33.27 26.63,31.96 DA1.8
RL+2  (via drill 0.35)
  Top 0.406: R10.2 23.88,24.62 v23.88,24.38
  Bottom 0.406: v23.88,24.38 23.88,23.36 DA4.8
RL+4
  Top 0.406: R36.2 22.39,48.24 DA6.8
RL-1  (via drill 0.35)
  Top 0.406: R4.1 29.72,31.51 v29.72,33.27
  Bottom 0.406: DA1.1 28.67,32.22 v29.72,33.27
RL-2  (via drill 0.35)
  Top 0.406: R10.1 29.72,24.88 v29.72,24.38
  Bottom 0.406: v29.72,24.38 29.72,24.12 DA4.1
RL-4
  Top 0.406: R36.1 25.91,48.78 25.91,49.78 26.89,50.76 DA6.1
RS+1
  Top 0.406: R15.2 26.63,42.95 DA5.8
RS+2  (via drill 0.35)
  Top 0.406: v20.32,49.02 20.07,48.77 R14.2
  Bottom 0.406: v20.32,49.02 20.03,48.73 DA2.8
RS+3  (via drill 0.35)
  Top 0.406: R9.2 28.21,45.99 v27.18,44.96
  Bottom 0.406: v27.18,44.96 27.65,44.49 DA3.8
RS-1
  Top 0.406: R15.1 22.13,43.96 DA5.1
RS-2  (via drill 0.35)
  Top 0.406: R14.1 20.07,43.96 19.3,43.2 v19.3,43.18
  Bottom 0.406: v19.3,43.18 17.27,43.18 DA2.1
RS-3  (via drill 0.35)
  Top 0.406: R9.1 28.21,47.99 v27.18,49.02
  Bottom 0.406: v27.18,49.02 28.45,49.02 DA3.1
SG_2_IN  (via drill 0.35)
  Top 0.406: X5.P$1 43.34,36.32 38.1,36.32 LR1IN.TP | DA5.3 23.44,40.82 23.88,40.39 23.88,37.83 R16.1 22.54,36.49 R2.2 23.88,34.29 v24.38,34.8
  Bottom 0.406: LR1IN.TP 34.8,36.58 30.48,36.58 28.7,34.8 v24.38,34.8
SG_4_IN
  Bottom 0.406: LR2IN.TP 39.88,38.35 39.88,48.58 R11.2 R17.1 | DA2.3 14.91,41.73 18.29,38.35 32.51,38.35 34.04,39.88 38.35,39.88 LR2IN.TP | X5.P$2 43.43,33.22 43.43,36.32 41.66,38.1 LR2IN.TP
SG_6_IN
  Bottom 0.406: X5.P$3 46.48,30.23 46.48,37.08 RR1IN.TP 44.96,41.15 44.96,51.56 41.98,54.54 R30.2 39.83,54.59 R18.1 33.51,54.59 29.79,50.87 DA3.3
SG_8_IN
  Top 0.406: X5.P$4 46.48,27.23 46.48,36.83 RR2IN.TP 49.53,45.97 40.96,54.54 R22.2 36.27,54.59 R21.1 30.46,54.59 28.77,52.9 DA6.3
SG_OUT_LR_1  (via drill 0.35)
  Top 0.406: R12.2 12.95,37.59 LR1.TP | v27.18,39.12 26.92,38.86 v26.92,37.08 | v24.64,42.42 24.64,41.91 25.73,40.82 DA5.6
  Bottom 0.406: v27.18,39.12 24.64,41.66 v24.64,42.42 | v26.92,37.08 LR1.TP 12.45,32.14 X1.P$8
SG_OUT_LR_2  (via drill 0.35)
  Top 0.406: R6.2 LR2.TP | v11.94,48.26 10.41,46.74 v9.4,46.74
  Bottom 0.406: DA2.6 14.91,47.5 13.97,47.5 13.21,48.26 v11.94,48.26 | v9.4,46.74 LR2.TP 10.67,35.81 10.67,34.54 11.43,33.78 11.43,30.16 X1.P$7
SG_OUT_RR_1  (via drill 0.35)
  Top 0.406: R5.2 16.26,36.58 RR1.TP 9.91,34.8 8.13,33.02 8.13,24.46 X1.P$1 | v30.73,39.88 28.19,37.34 v28.19,36.07
  Bottom 0.406: RR1.TP 15.75,36.07 v28.19,36.07 | DA3.6 29.79,40.06 29.97,39.88 v30.73,39.88
SG_OUT_RR_2  (via drill 0.35)
  Top 0.406: R7.2 RR2.TP | v5.84,46.48 5.84,49.28 9.91,53.34 19.81,53.34 20.25,52.9 DA6.6
  Bottom 0.406: v5.84,46.48 5.84,37.34 RR2.TP 6.1,33.02 8.13,30.99 8.13,27.46 X1.P$2
SUS_IN_1
  Top 0.406: R28.2 R27.1 38.37,17.8 41.96,21.38 X5.P$10
SUS_IN_2
  Top 0.406: R35.2 R34.1 36.72,14.46 X5.P$5
SUS_RL
  Top 0.406: SV2.1 15.47,23.11 X1.P$6
  Bottom 0.406: R33.1 17.24,18.78 R32.2 17,22.62 SV2.1
SUS_RR
  Top 0.406: R20.1 14.21,19.3 R19.2 12.91,20.6 X1.P$5
  Bottom 0.406: X1.P$5 15.88,25.65 SV2.2
(copper drawn outside any net)
  shapes: Top area x2

### Text on the board
tNames: R- | LR | R+ | L- | LL | L+ | SR | SL | GND | SUSRin | SLin | 12out | 12in | 5out | 5in | 12in
bNames: fuse